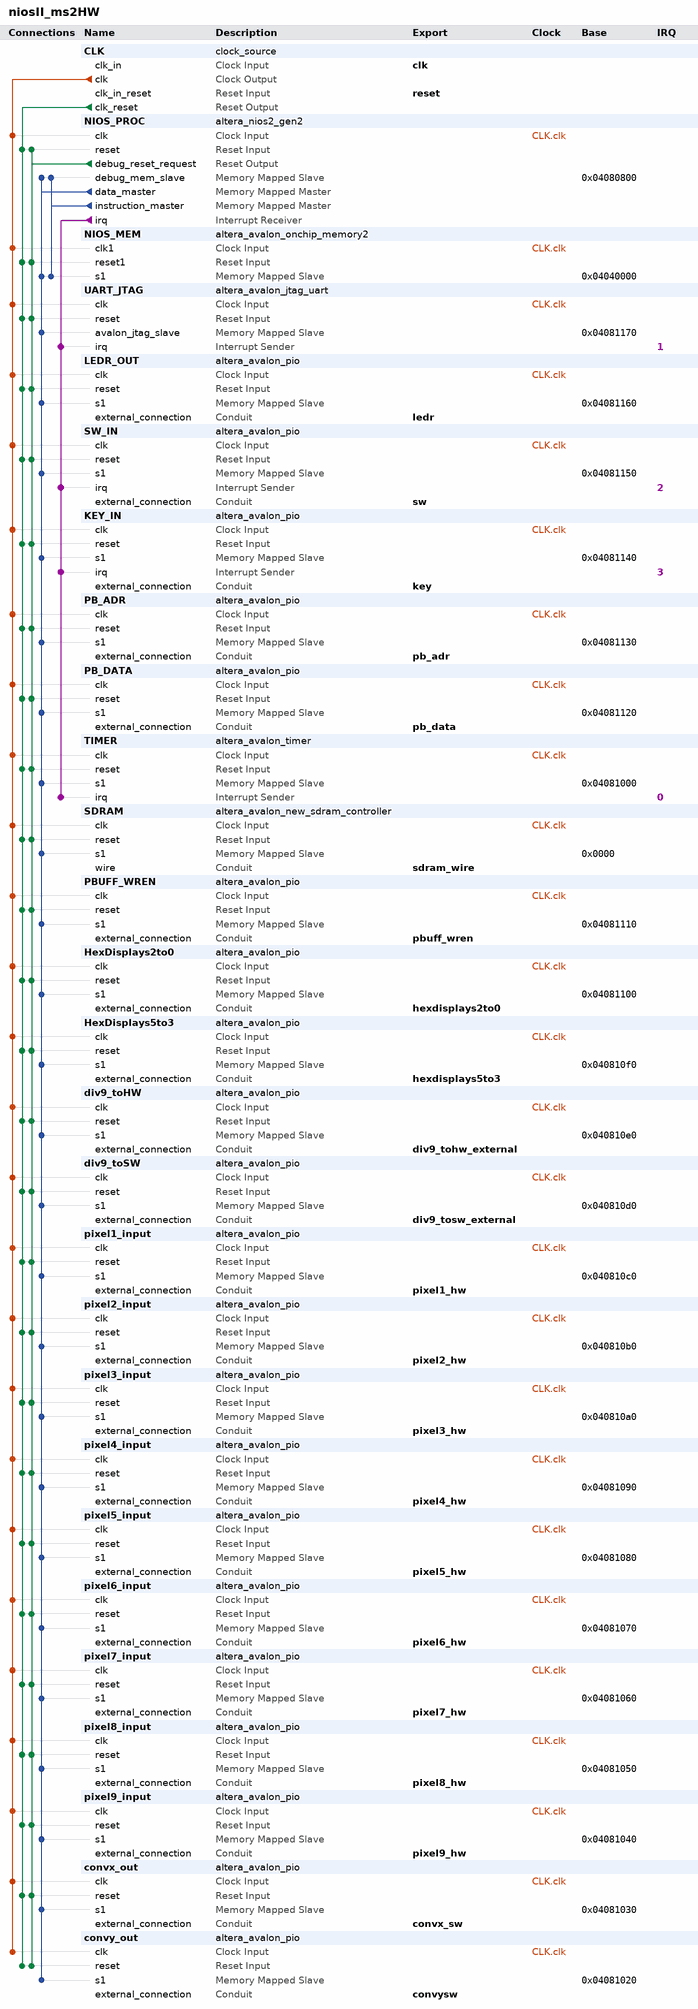
[diagram p0: system contents]
# Platform Designer (Qsys) system niosII_ms2HW, MAX 10 10M50DAF484C7G
# Parameters at their usual value, and those the tool derives, are not listed.
package require -exact qsys 18.1
create_system niosII_ms2HW
set_project_property DEVICE_FAMILY {MAX 10}
set_project_property DEVICE 10M50DAF484C7G

add_instance CLK clock_source 18.1
set_instance_parameter_value CLK clockFrequency 50000000

add_instance NIOS_PROC altera_nios2_gen2 18.1
set_instance_parameter_value NIOS_PROC dcache_size 2048
set_instance_parameter_value NIOS_PROC exceptionSlave NIOS_MEM.s1
set_instance_parameter_value NIOS_PROC icache_size 4096
set_instance_parameter_value NIOS_PROC impl Fast
set_instance_parameter_value NIOS_PROC resetSlave NIOS_MEM.s1

add_instance NIOS_MEM altera_avalon_onchip_memory2 18.1
set_instance_parameter_value NIOS_MEM dataWidth 32
set_instance_parameter_value NIOS_MEM dualPort false
set_instance_parameter_value NIOS_MEM initMemContent false
set_instance_parameter_value NIOS_MEM initializationFileName onchip_mem.hex
set_instance_parameter_value NIOS_MEM memorySize 132000

add_instance UART_JTAG altera_avalon_jtag_uart 18.1
set_instance_parameter_value UART_JTAG simInteractiveOptions NO_INTERACTIVE_WINDOWS

add_instance LEDR_OUT altera_avalon_pio 18.1
set_instance_parameter_value LEDR_OUT direction Output
set_instance_parameter_value LEDR_OUT width 10

add_instance SW_IN altera_avalon_pio 18.1
set_instance_parameter_value SW_IN captureEdge true
set_instance_parameter_value SW_IN direction Input
set_instance_parameter_value SW_IN edgeType ANY
set_instance_parameter_value SW_IN generateIRQ true
set_instance_parameter_value SW_IN irqType EDGE
set_instance_parameter_value SW_IN width 10

add_instance KEY_IN altera_avalon_pio 18.1
set_instance_parameter_value KEY_IN captureEdge true
set_instance_parameter_value KEY_IN direction Input
set_instance_parameter_value KEY_IN generateIRQ true
set_instance_parameter_value KEY_IN irqType EDGE
set_instance_parameter_value KEY_IN width 2

add_instance PB_ADR altera_avalon_pio 18.1
set_instance_parameter_value PB_ADR direction Output
set_instance_parameter_value PB_ADR width 15

add_instance PB_DATA altera_avalon_pio 18.1
set_instance_parameter_value PB_DATA direction Output
set_instance_parameter_value PB_DATA width 4

add_instance TIMER altera_avalon_timer 18.1
set_instance_parameter_value TIMER period 1
set_instance_parameter_value TIMER periodUnits MSEC

add_instance SDRAM altera_avalon_new_sdram_controller 18.1
set_instance_parameter_value SDRAM TAC 5.5
set_instance_parameter_value SDRAM TRCD 20.0
set_instance_parameter_value SDRAM TRP 20.0
set_instance_parameter_value SDRAM casLatency 3
set_instance_parameter_value SDRAM columnWidth 10
set_instance_parameter_value SDRAM dataWidth 16
set_instance_parameter_value SDRAM generateSimulationModel false
set_instance_parameter_value SDRAM model single_Micron_MT48LC4M32B2_7_chip
set_instance_parameter_value SDRAM numberOfBanks 4
set_instance_parameter_value SDRAM numberOfChipSelects 1
set_instance_parameter_value SDRAM powerUpDelay 100.0
set_instance_parameter_value SDRAM refreshPeriod 15.625
set_instance_parameter_value SDRAM rowWidth 13

add_instance PBUFF_WREN altera_avalon_pio 18.1
set_instance_parameter_value PBUFF_WREN direction Output
set_instance_parameter_value PBUFF_WREN width 1

add_instance HexDisplays2to0 altera_avalon_pio 18.1
set_instance_parameter_value HexDisplays2to0 direction Output
set_instance_parameter_value HexDisplays2to0 width 24

add_instance HexDisplays5to3 altera_avalon_pio 18.1
set_instance_parameter_value HexDisplays5to3 direction Output
set_instance_parameter_value HexDisplays5to3 width 24

add_instance div9_toHW altera_avalon_pio 18.1
set_instance_parameter_value div9_toHW direction Output
set_instance_parameter_value div9_toHW width 8

add_instance div9_toSW altera_avalon_pio 18.1
set_instance_parameter_value div9_toSW direction Input
set_instance_parameter_value div9_toSW width 8

add_instance pixel1_input altera_avalon_pio 18.1
set_instance_parameter_value pixel1_input direction Output
set_instance_parameter_value pixel1_input width 8

add_instance pixel2_input altera_avalon_pio 18.1
set_instance_parameter_value pixel2_input direction Output
set_instance_parameter_value pixel2_input width 8

add_instance pixel3_input altera_avalon_pio 18.1
set_instance_parameter_value pixel3_input direction Output
set_instance_parameter_value pixel3_input width 8

add_instance pixel4_input altera_avalon_pio 18.1
set_instance_parameter_value pixel4_input direction Output
set_instance_parameter_value pixel4_input width 8

add_instance pixel5_input altera_avalon_pio 18.1
set_instance_parameter_value pixel5_input direction Output
set_instance_parameter_value pixel5_input width 8

add_instance pixel6_input altera_avalon_pio 18.1
set_instance_parameter_value pixel6_input direction Output
set_instance_parameter_value pixel6_input width 8

add_instance pixel7_input altera_avalon_pio 18.1
set_instance_parameter_value pixel7_input direction Output
set_instance_parameter_value pixel7_input width 8

add_instance pixel8_input altera_avalon_pio 18.1
set_instance_parameter_value pixel8_input direction Output
set_instance_parameter_value pixel8_input width 8

add_instance pixel9_input altera_avalon_pio 18.1
set_instance_parameter_value pixel9_input direction Output
set_instance_parameter_value pixel9_input width 8

add_instance convx_out altera_avalon_pio 18.1
set_instance_parameter_value convx_out direction Input
set_instance_parameter_value convx_out width 8

add_instance convy_out altera_avalon_pio 18.1
set_instance_parameter_value convy_out direction Input
set_instance_parameter_value convy_out width 8

# connections
add_connection CLK.clk convx_out.clk clock
add_connection CLK.clk convy_out.clk clock
add_connection CLK.clk div9_toHW.clk clock
add_connection CLK.clk div9_toSW.clk clock
add_connection CLK.clk HexDisplays2to0.clk clock
add_connection CLK.clk HexDisplays5to3.clk clock
add_connection CLK.clk KEY_IN.clk clock
add_connection CLK.clk LEDR_OUT.clk clock
add_connection CLK.clk NIOS_MEM.clk1 clock
add_connection CLK.clk NIOS_PROC.clk clock
add_connection CLK.clk PB_ADR.clk clock
add_connection CLK.clk PB_DATA.clk clock
add_connection CLK.clk PBUFF_WREN.clk clock
add_connection CLK.clk pixel1_input.clk clock
add_connection CLK.clk pixel2_input.clk clock
add_connection CLK.clk pixel3_input.clk clock
add_connection CLK.clk pixel4_input.clk clock
add_connection CLK.clk pixel5_input.clk clock
add_connection CLK.clk pixel6_input.clk clock
add_connection CLK.clk pixel7_input.clk clock
add_connection CLK.clk pixel8_input.clk clock
add_connection CLK.clk pixel9_input.clk clock
add_connection CLK.clk SDRAM.clk clock
add_connection CLK.clk SW_IN.clk clock
add_connection CLK.clk TIMER.clk clock
add_connection CLK.clk UART_JTAG.clk clock
add_connection CLK.clk_reset convx_out.reset reset
add_connection CLK.clk_reset convy_out.reset reset
add_connection CLK.clk_reset div9_toHW.reset reset
add_connection CLK.clk_reset div9_toSW.reset reset
add_connection CLK.clk_reset HexDisplays2to0.reset reset
add_connection CLK.clk_reset HexDisplays5to3.reset reset
add_connection CLK.clk_reset KEY_IN.reset reset
add_connection CLK.clk_reset LEDR_OUT.reset reset
add_connection CLK.clk_reset NIOS_MEM.reset1 reset
add_connection CLK.clk_reset NIOS_PROC.reset reset
add_connection CLK.clk_reset PB_ADR.reset reset
add_connection CLK.clk_reset PB_DATA.reset reset
add_connection CLK.clk_reset PBUFF_WREN.reset reset
add_connection CLK.clk_reset pixel1_input.reset reset
add_connection CLK.clk_reset pixel2_input.reset reset
add_connection CLK.clk_reset pixel3_input.reset reset
add_connection CLK.clk_reset pixel4_input.reset reset
add_connection CLK.clk_reset pixel5_input.reset reset
add_connection CLK.clk_reset pixel6_input.reset reset
add_connection CLK.clk_reset pixel7_input.reset reset
add_connection CLK.clk_reset pixel8_input.reset reset
add_connection CLK.clk_reset pixel9_input.reset reset
add_connection CLK.clk_reset SDRAM.reset reset
add_connection CLK.clk_reset SW_IN.reset reset
add_connection CLK.clk_reset TIMER.reset reset
add_connection CLK.clk_reset UART_JTAG.reset reset
add_connection NIOS_PROC.debug_reset_request convx_out.reset reset
add_connection NIOS_PROC.debug_reset_request convy_out.reset reset
add_connection NIOS_PROC.debug_reset_request div9_toHW.reset reset
add_connection NIOS_PROC.debug_reset_request div9_toSW.reset reset
add_connection NIOS_PROC.debug_reset_request HexDisplays2to0.reset reset
add_connection NIOS_PROC.debug_reset_request HexDisplays5to3.reset reset
add_connection NIOS_PROC.debug_reset_request KEY_IN.reset reset
add_connection NIOS_PROC.debug_reset_request LEDR_OUT.reset reset
add_connection NIOS_PROC.debug_reset_request NIOS_MEM.reset1 reset
add_connection NIOS_PROC.debug_reset_request NIOS_PROC.reset reset
add_connection NIOS_PROC.debug_reset_request PB_ADR.reset reset
add_connection NIOS_PROC.debug_reset_request PB_DATA.reset reset
add_connection NIOS_PROC.debug_reset_request PBUFF_WREN.reset reset
add_connection NIOS_PROC.debug_reset_request pixel1_input.reset reset
add_connection NIOS_PROC.debug_reset_request pixel2_input.reset reset
add_connection NIOS_PROC.debug_reset_request pixel3_input.reset reset
add_connection NIOS_PROC.debug_reset_request pixel4_input.reset reset
add_connection NIOS_PROC.debug_reset_request pixel5_input.reset reset
add_connection NIOS_PROC.debug_reset_request pixel6_input.reset reset
add_connection NIOS_PROC.debug_reset_request pixel7_input.reset reset
add_connection NIOS_PROC.debug_reset_request pixel8_input.reset reset
add_connection NIOS_PROC.debug_reset_request pixel9_input.reset reset
add_connection NIOS_PROC.debug_reset_request SDRAM.reset reset
add_connection NIOS_PROC.debug_reset_request SW_IN.reset reset
add_connection NIOS_PROC.debug_reset_request TIMER.reset reset
add_connection NIOS_PROC.debug_reset_request UART_JTAG.reset reset
add_connection NIOS_PROC.data_master convx_out.s1 avalon
set_connection_parameter_value NIOS_PROC.data_master/convx_out.s1 baseAddress 0x04081030
add_connection NIOS_PROC.data_master convy_out.s1 avalon
set_connection_parameter_value NIOS_PROC.data_master/convy_out.s1 baseAddress 0x04081020
add_connection NIOS_PROC.data_master div9_toHW.s1 avalon
set_connection_parameter_value NIOS_PROC.data_master/div9_toHW.s1 baseAddress 0x040810e0
add_connection NIOS_PROC.data_master div9_toSW.s1 avalon
set_connection_parameter_value NIOS_PROC.data_master/div9_toSW.s1 baseAddress 0x040810d0
add_connection NIOS_PROC.data_master HexDisplays2to0.s1 avalon
set_connection_parameter_value NIOS_PROC.data_master/HexDisplays2to0.s1 baseAddress 0x04081100
add_connection NIOS_PROC.data_master HexDisplays5to3.s1 avalon
set_connection_parameter_value NIOS_PROC.data_master/HexDisplays5to3.s1 baseAddress 0x040810f0
add_connection NIOS_PROC.data_master KEY_IN.s1 avalon
set_connection_parameter_value NIOS_PROC.data_master/KEY_IN.s1 baseAddress 0x04081140
add_connection NIOS_PROC.data_master LEDR_OUT.s1 avalon
set_connection_parameter_value NIOS_PROC.data_master/LEDR_OUT.s1 baseAddress 0x04081160
add_connection NIOS_PROC.data_master NIOS_MEM.s1 avalon
set_connection_parameter_value NIOS_PROC.data_master/NIOS_MEM.s1 baseAddress 0x04040000
add_connection NIOS_PROC.data_master NIOS_PROC.debug_mem_slave avalon
set_connection_parameter_value NIOS_PROC.data_master/NIOS_PROC.debug_mem_slave baseAddress 0x04080800
add_connection NIOS_PROC.data_master PB_ADR.s1 avalon
set_connection_parameter_value NIOS_PROC.data_master/PB_ADR.s1 baseAddress 0x04081130
add_connection NIOS_PROC.data_master PB_DATA.s1 avalon
set_connection_parameter_value NIOS_PROC.data_master/PB_DATA.s1 baseAddress 0x04081120
add_connection NIOS_PROC.data_master PBUFF_WREN.s1 avalon
set_connection_parameter_value NIOS_PROC.data_master/PBUFF_WREN.s1 baseAddress 0x04081110
add_connection NIOS_PROC.data_master pixel1_input.s1 avalon
set_connection_parameter_value NIOS_PROC.data_master/pixel1_input.s1 baseAddress 0x040810c0
add_connection NIOS_PROC.data_master pixel2_input.s1 avalon
set_connection_parameter_value NIOS_PROC.data_master/pixel2_input.s1 baseAddress 0x040810b0
add_connection NIOS_PROC.data_master pixel3_input.s1 avalon
set_connection_parameter_value NIOS_PROC.data_master/pixel3_input.s1 baseAddress 0x040810a0
add_connection NIOS_PROC.data_master pixel4_input.s1 avalon
set_connection_parameter_value NIOS_PROC.data_master/pixel4_input.s1 baseAddress 0x04081090
add_connection NIOS_PROC.data_master pixel5_input.s1 avalon
set_connection_parameter_value NIOS_PROC.data_master/pixel5_input.s1 baseAddress 0x04081080
add_connection NIOS_PROC.data_master pixel6_input.s1 avalon
set_connection_parameter_value NIOS_PROC.data_master/pixel6_input.s1 baseAddress 0x04081070
add_connection NIOS_PROC.data_master pixel7_input.s1 avalon
set_connection_parameter_value NIOS_PROC.data_master/pixel7_input.s1 baseAddress 0x04081060
add_connection NIOS_PROC.data_master pixel8_input.s1 avalon
set_connection_parameter_value NIOS_PROC.data_master/pixel8_input.s1 baseAddress 0x04081050
add_connection NIOS_PROC.data_master pixel9_input.s1 avalon
set_connection_parameter_value NIOS_PROC.data_master/pixel9_input.s1 baseAddress 0x04081040
add_connection NIOS_PROC.data_master SDRAM.s1 avalon
set_connection_parameter_value NIOS_PROC.data_master/SDRAM.s1 baseAddress 0x0000
add_connection NIOS_PROC.data_master SW_IN.s1 avalon
set_connection_parameter_value NIOS_PROC.data_master/SW_IN.s1 baseAddress 0x04081150
add_connection NIOS_PROC.data_master TIMER.s1 avalon
set_connection_parameter_value NIOS_PROC.data_master/TIMER.s1 baseAddress 0x04081000
add_connection NIOS_PROC.data_master UART_JTAG.avalon_jtag_slave avalon
set_connection_parameter_value NIOS_PROC.data_master/UART_JTAG.avalon_jtag_slave baseAddress 0x04081170
add_connection NIOS_PROC.instruction_master NIOS_MEM.s1 avalon
set_connection_parameter_value NIOS_PROC.instruction_master/NIOS_MEM.s1 baseAddress 0x04040000
add_connection NIOS_PROC.instruction_master NIOS_PROC.debug_mem_slave avalon
set_connection_parameter_value NIOS_PROC.instruction_master/NIOS_PROC.debug_mem_slave baseAddress 0x04080800
add_connection NIOS_PROC.irq KEY_IN.irq interrupt
set_connection_parameter_value NIOS_PROC.irq/KEY_IN.irq irqNumber 3
add_connection NIOS_PROC.irq SW_IN.irq interrupt
set_connection_parameter_value NIOS_PROC.irq/SW_IN.irq irqNumber 2
add_connection NIOS_PROC.irq TIMER.irq interrupt
set_connection_parameter_value NIOS_PROC.irq/TIMER.irq irqNumber 0
add_connection NIOS_PROC.irq UART_JTAG.irq interrupt
set_connection_parameter_value NIOS_PROC.irq/UART_JTAG.irq irqNumber 1

# exported interfaces
add_interface clk clock sink
set_interface_property clk EXPORT_OF CLK.clk_in
add_interface convx_sw conduit end
set_interface_property convx_sw EXPORT_OF convx_out.external_connection
add_interface convysw conduit end
set_interface_property convysw EXPORT_OF convy_out.external_connection
add_interface div9_tohw_external conduit end
set_interface_property div9_tohw_external EXPORT_OF div9_toHW.external_connection
add_interface div9_tosw_external conduit end
set_interface_property div9_tosw_external EXPORT_OF div9_toSW.external_connection
add_interface hexdisplays2to0 conduit end
set_interface_property hexdisplays2to0 EXPORT_OF HexDisplays2to0.external_connection
add_interface hexdisplays5to3 conduit end
set_interface_property hexdisplays5to3 EXPORT_OF HexDisplays5to3.external_connection
add_interface key conduit end
set_interface_property key EXPORT_OF KEY_IN.external_connection
add_interface ledr conduit end
set_interface_property ledr EXPORT_OF LEDR_OUT.external_connection
add_interface pb_adr conduit end
set_interface_property pb_adr EXPORT_OF PB_ADR.external_connection
add_interface pb_data conduit end
set_interface_property pb_data EXPORT_OF PB_DATA.external_connection
add_interface pbuff_wren conduit end
set_interface_property pbuff_wren EXPORT_OF PBUFF_WREN.external_connection
add_interface pixel1_hw conduit end
set_interface_property pixel1_hw EXPORT_OF pixel1_input.external_connection
add_interface pixel2_hw conduit end
set_interface_property pixel2_hw EXPORT_OF pixel2_input.external_connection
add_interface pixel3_hw conduit end
set_interface_property pixel3_hw EXPORT_OF pixel3_input.external_connection
add_interface pixel4_hw conduit end
set_interface_property pixel4_hw EXPORT_OF pixel4_input.external_connection
add_interface pixel5_hw conduit end
set_interface_property pixel5_hw EXPORT_OF pixel5_input.external_connection
add_interface pixel6_hw conduit end
set_interface_property pixel6_hw EXPORT_OF pixel6_input.external_connection
add_interface pixel7_hw conduit end
set_interface_property pixel7_hw EXPORT_OF pixel7_input.external_connection
add_interface pixel8_hw conduit end
set_interface_property pixel8_hw EXPORT_OF pixel8_input.external_connection
add_interface pixel9_hw conduit end
set_interface_property pixel9_hw EXPORT_OF pixel9_input.external_connection
add_interface reset reset sink
set_interface_property reset EXPORT_OF CLK.clk_in_reset
add_interface sdram_wire conduit end
set_interface_property sdram_wire EXPORT_OF SDRAM.wire
add_interface sw conduit end
set_interface_property sw EXPORT_OF SW_IN.external_connection

set_interconnect_requirement {$system} qsys_mm.clockCrossingAdapter HANDSHAKE
set_interconnect_requirement {$system} qsys_mm.enableEccProtection FALSE
set_interconnect_requirement {$system} qsys_mm.insertDefaultSlave FALSE
set_interconnect_requirement {$system} qsys_mm.maxAdditionalLatency 1

save_system niosII_ms2HW.qsys
